# Altium schematic sheet Sheet_1.schdoc
size 187 x 177 mm
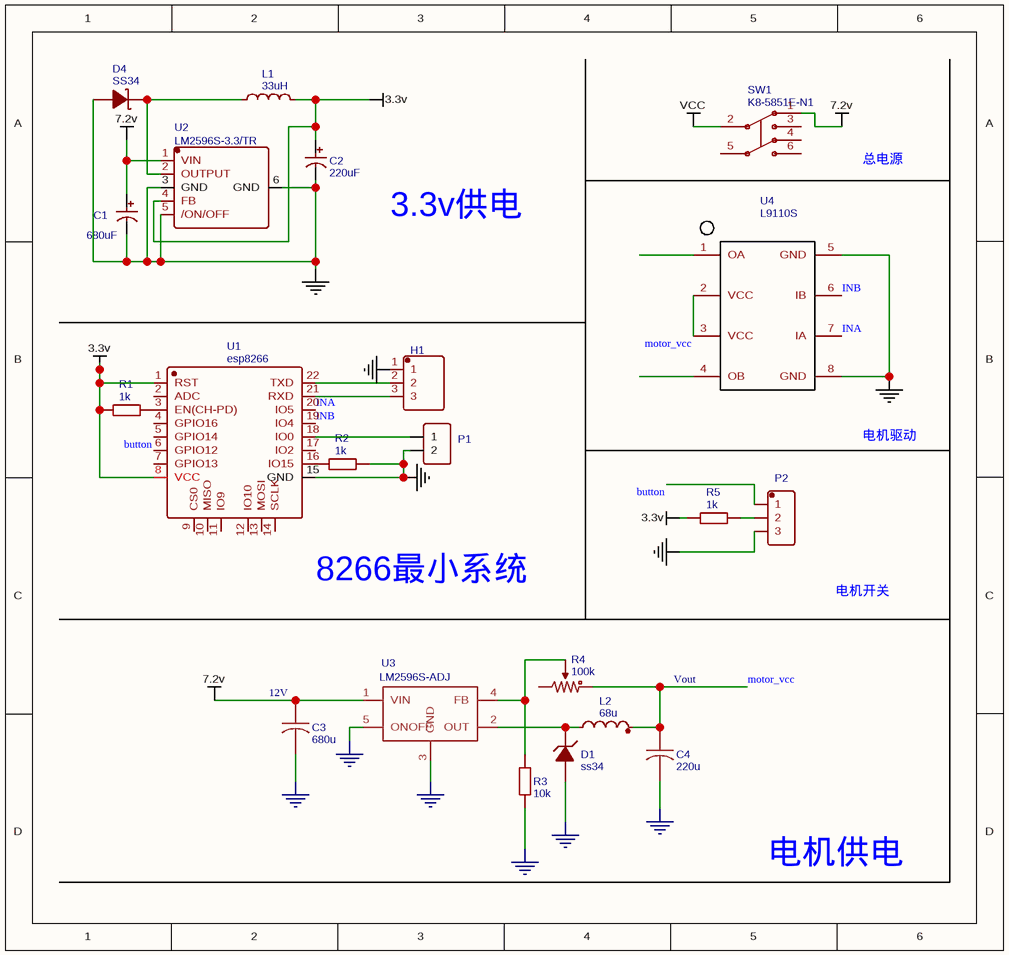
[diagram p0: Sheet_1.schdoc]

## Parts
C1  680uF  [8*12电解电容]
C2  220uF  [8*12电解电容]
C3  680u  [8*12电解电容]
C4  220u  [8*12电解电容]
D1  ss34  [SMA/DO-214AC]
D4  SS34  [SMA(DO-214AC)]
H1  串口  [排针*3]  (value not drawn)
L1  33uH  [7.5*7.5贴片电感]
L2  68u  [7.5*7.5贴片电感]
P1  Header-Female-2.54_1x2  [HDR-1X2/2.54]  (value not drawn)
P2  WJ2EDGVC-5.08-3P  [WJ2EDGVC-5.08-3P]  (value not drawn)
R1  1k  [0805]
R2  1k  [0805]
R3  10k  [0805]
R4  100k  [卧式电位器]
R5  1k  [0805]
SW1  K8-5851E-N1  [KEY-6X6]
U1  esp8266  [ESP-12F(ESP8266MOD)]
U2  LM2596S-3.3/TR  [TO-263-5]
U3  LM2596S-ADJ  [TO263-5]
U4  L9110S  [SOP8]

## Nets
3.3v: C2.1 L1.2 R1.1 R5.1 U1.1(RST) U1.8(VCC) U2.4(FB)
12V: C1.1 C3.1 SW1.1 U2.1(VIN) U3.1(VIN)  [also labelled 7.2v]
GND: C1.2 C2.2 C3.2 C4.2 D1.1(A) D4.1(A) H1.1 P1.2 P2.3 R2.2 R3.1 U1.15(GND) U2.3(GND) U2.5(/ON/OFF) U2.6(GND) U3.3(GND) U3.5(ONOFF) U4.5(GND) U4.8(GND)
VCC: SW1.2
button: P2.1 U1.5(GPIO14)
INA: U1.20(IO5) U4.7(IA)
INB: U1.19(IO4) U4.6(IB)
motor_vcc: C4.1 L2.2 R4.3 U4.2(VCC) U4.3(VCC)  [also labelled Vout]
NetD1_2: D1.2(K) L2.1 U3.2(OUT)
NetD4_2: D4.2(K) L1.1 U2.2(OUTPUT)
NetH1_2: H1.2 U1.22(TXD)
NetH1_3: H1.3 U1.21(RXD)
NetP1_1: P1.1 U1.18(IO0)
NetP2_2: P2.2 R5.2
NetR1_2: R1.2 U1.3(EN(CH-PD))
NetR2_1: R2.1 U1.16(IO15)
NetR3_2: R3.2 R4.2 U3.4(FB)

Not connected (* = marked no-connect by the designer): R4 1; SW1 3 4 5 6; U1 2(ADC) 4(GPIO16) 6(GPIO12) 7(GPIO13) 9(CS0) 10(MISO) 11(IO9) 12(IO10) 13(MOSI) 14(SCLK) 17(IO2); U4 1(OA) 4(OB)

## Notes on the sheet
- 总电源
- 3.3v供电
- 电机驱动
- (near U1) 8266最小系统
- 电机开关
- 电机供电

## Library data of the parts
C1 = 680uF: BOM_Manufacturer: ValuePro; BOM_Manufacturer Part: 680uF 16V绿金 8*12; nameAlias: Capacitance; BOM_Supplier: LCSC; BOM_Supplier Part: C43826; spicePre: C; spiceSymbolName: 680uF 16V绿金 8*12
C2 = 220uF: BOM_Manufacturer: ValuePro; BOM_Manufacturer Part: 220uf/63V; nameAlias: Capacitance; BOM_Supplier: LCSC; BOM_Supplier Part: C47290; spicePre: C; spiceSymbolName: 220uf/63V
C3 = 680u: nameAlias: Value(F); BOM_Manufacturer Part: ?; spicePre: C; spiceSymbolName: Capacitor
C4 = 220u: nameAlias: Value(F); BOM_Manufacturer Part: ?; spicePre: C; spiceSymbolName: Capacitor
D1 = ss34: nameAlias: Model; spicePre: X; BOM_Manufacturer Part: ?; spiceSymbolName: Zener
D4 = SS34: BOM_Manufacturer: Yenji; Contributor: LCSC; BOM_Supplier: LCSC; BOM_Manufacturer Part: SS34; BOM_Supplier Part: C142458; BOM_LCSC Assembly: Yes; spicePre: D
H1 = 串口: BOM_Manufacturer: Amphenol ICC; BOM_Manufacturer Part: 68000-103HLF; Contributor: LCSC; BOM_Supplier: LCSC; BOM_Supplier Part: C168677; spicePre: H
L1 = 33uH: BOM_Manufacturer: Sunlord; BOM_Manufacturer Part: ASWPA4035S330MT; nameAlias: Value; Contributor: LCSC; BOM_Supplier: LCSC; BOM_Supplier Part: C340215; spicePre: L; spiceSymbolName: ASWPA4035S330MT
L2 = 68u: nameAlias: Value(H); BOM_Manufacturer Part: ?; spicePre: L; spiceSymbolName: Inductor
P1 = Header-Female-2.54_1x2: BOM_Manufacturer: BOOMELE; BOM_Manufacturer Part: 2.54-1*2PFemale; BOM_Supplier: LCSC; image: //image.lceda.cn/szlcsc/C49661.jpg; BOM_Supplier Part: C49661; spicePre: P
P2 = WJ2EDGVC-5.08-3P: BOM_Manufacturer: ReliaPro; spicePre: X; BOM_Supplier: LCSC; BOM_Manufacturer Part: WJ2EDGVC-5.08-3P; image: //image.lceda.cn/szlcsc/C8430.jpg; BOM_Supplier Part: C8430
R1 R2 R5 = 1k: nameAlias: Value(Ω); BOM_Manufacturer Part: ?; spicePre: R; spiceSymbolName: Res_AXIAL-0.3(1/8W)_EU
R3 = 10k: nameAlias: Value(Ω); BOM_Manufacturer Part: ?; spicePre: R; spiceSymbolName: Resistor
R4 = 100k: nameAlias: Value(Ω); Model: Potentiometer; K(%): 50; spicePre: X; BOM_Manufacturer Part: ?; spiceSymbolName: Potentiometer
SW1 = K8-5851E-N1: BOM_Manufacturer: HRO; Contributor: LCSC; BOM_Supplier: LCSC; BOM_Manufacturer Part: K8-5851E-N1; BOM_Supplier Part: C134191; spicePre: S
U1 = esp8266: BOM_Manufacturer: Ai-Thinker; BOM_Supplier: LCSC; BOM_Manufacturer Part: ESP-12F(ESP8266MOD); BOM_Supplier Part: C82891; spicePre: U
U2 = LM2596S-3.3/TR: BOM_Manufacturer: HGSEMI; Contributor: LCSC; BOM_Supplier: LCSC; BOM_Supplier Part: C194350; BOM_Manufacturer Part: LM2596S-3.3/TR; spicePre: U
U3 = LM2596S-ADJ: catid: 20; Contributor: KiCad; sourceId: bhfBXUSQO; BOM_Manufacturer Part: ?; spicePre: U
U4 = L9110S: Contributor: h1997l1997; BOM_Manufacturer Part: ?; spicePre: U